# EAGLE design Backplane (EAGLE 8.5.1)
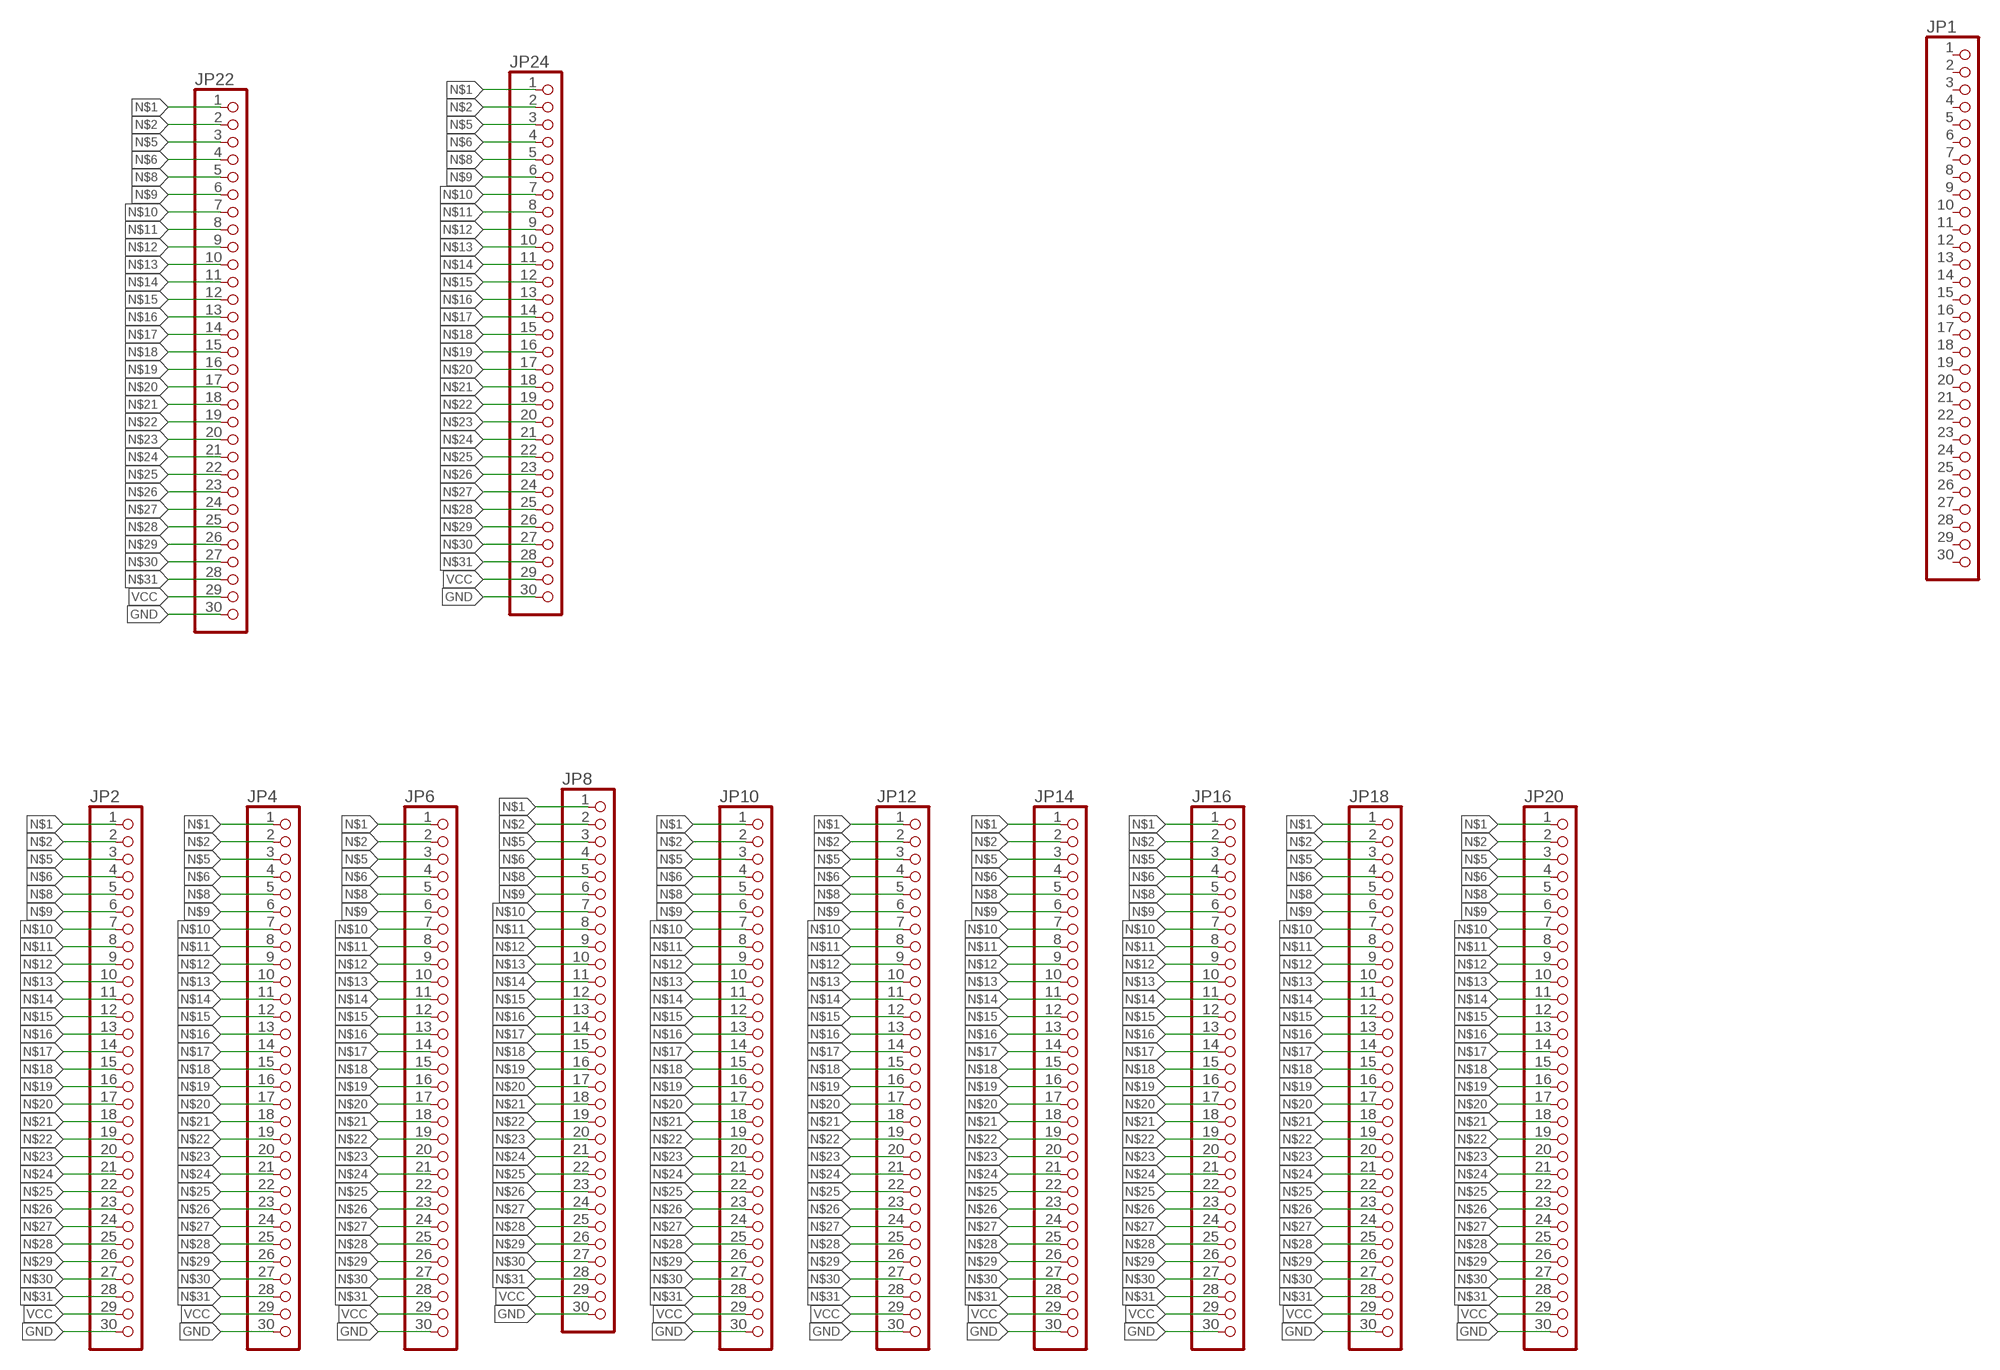
[diagram p0: schematic, sheet 1]

## Parts
JP1  PINHD-1X30  [1X30]
JP2  PINHD-1X30  [1X30]
JP4  PINHD-1X30  [1X30]
JP6  PINHD-1X30  [1X30]
JP8  PINHD-1X30  [1X30]
JP10  PINHD-1X30  [1X30]
JP12  PINHD-1X30  [1X30]
JP14  PINHD-1X30  [1X30]
JP16  PINHD-1X30  [1X30]
JP18  PINHD-1X30  [1X30]
JP20  PINHD-1X30  [1X30]
JP22  PINHD-1X30  [1X30]
JP24  PINHD-1X30  [1X30]

## Nets
GND: JP2.30 JP4.30 JP6.30 JP8.30 JP10.30 JP12.30 JP14.30 JP16.30 JP18.30 JP20.30 JP22.30 JP24.30
N$1: JP2.1 JP4.1 JP6.1 JP8.1 JP10.1 JP12.1 JP14.1 JP16.1 JP18.1 JP20.1 JP22.1 JP24.1
N$2: JP2.2 JP4.2 JP6.2 JP8.2 JP10.2 JP12.2 JP14.2 JP16.2 JP18.2 JP20.2 JP22.2 JP24.2
N$5: JP2.3 JP4.3 JP6.3 JP8.3 JP10.3 JP12.3 JP14.3 JP16.3 JP18.3 JP20.3 JP22.3 JP24.3
N$6: JP2.4 JP4.4 JP6.4 JP8.4 JP10.4 JP12.4 JP14.4 JP16.4 JP18.4 JP20.4 JP22.4 JP24.4
N$8: JP2.5 JP4.5 JP6.5 JP8.5 JP10.5 JP12.5 JP14.5 JP16.5 JP18.5 JP20.5 JP22.5 JP24.5
N$9: JP2.6 JP4.6 JP6.6 JP8.6 JP10.6 JP12.6 JP14.6 JP16.6 JP18.6 JP20.6 JP22.6 JP24.6
N$10: JP2.7 JP4.7 JP6.7 JP8.7 JP10.7 JP12.7 JP14.7 JP16.7 JP18.7 JP20.7 JP22.7 JP24.7
N$11: JP2.8 JP4.8 JP6.8 JP8.8 JP10.8 JP12.8 JP14.8 JP16.8 JP18.8 JP20.8 JP22.8 JP24.8
N$12: JP2.9 JP4.9 JP6.9 JP8.9 JP10.9 JP12.9 JP14.9 JP16.9 JP18.9 JP20.9 JP22.9 JP24.9
N$13: JP2.10 JP4.10 JP6.10 JP8.10 JP10.10 JP12.10 JP14.10 JP16.10 JP18.10 JP20.10 JP22.10 JP24.10
N$14: JP2.11 JP4.11 JP6.11 JP8.11 JP10.11 JP12.11 JP14.11 JP16.11 JP18.11 JP20.11 JP22.11 JP24.11
N$15: JP2.12 JP4.12 JP6.12 JP8.12 JP10.12 JP12.12 JP14.12 JP16.12 JP18.12 JP20.12 JP22.12 JP24.12
N$16: JP2.13 JP4.13 JP6.13 JP8.13 JP10.13 JP12.13 JP14.13 JP16.13 JP18.13 JP20.13 JP22.13 JP24.13
N$17: JP2.14 JP4.14 JP6.14 JP8.14 JP10.14 JP12.14 JP14.14 JP16.14 JP18.14 JP20.14 JP22.14 JP24.14
N$18: JP2.15 JP4.15 JP6.15 JP8.15 JP10.15 JP12.15 JP14.15 JP16.15 JP18.15 JP20.15 JP22.15 JP24.15
N$19: JP2.16 JP4.16 JP6.16 JP8.16 JP10.16 JP12.16 JP14.16 JP16.16 JP18.16 JP20.16 JP22.16 JP24.16
N$20: JP2.17 JP4.17 JP6.17 JP8.17 JP10.17 JP12.17 JP14.17 JP16.17 JP18.17 JP20.17 JP22.17 JP24.17
N$21: JP2.18 JP4.18 JP6.18 JP8.18 JP10.18 JP12.18 JP14.18 JP16.18 JP18.18 JP20.18 JP22.18 JP24.18
N$22: JP2.19 JP4.19 JP6.19 JP8.19 JP10.19 JP12.19 JP14.19 JP16.19 JP18.19 JP20.19 JP22.19 JP24.19
N$23: JP2.20 JP4.20 JP6.20 JP8.20 JP10.20 JP12.20 JP14.20 JP16.20 JP18.20 JP20.20 JP22.20 JP24.20
N$24: JP2.21 JP4.21 JP6.21 JP8.21 JP10.21 JP12.21 JP14.21 JP16.21 JP18.21 JP20.21 JP22.21 JP24.21
N$25: JP2.22 JP4.22 JP6.22 JP8.22 JP10.22 JP12.22 JP14.22 JP16.22 JP18.22 JP20.22 JP22.22 JP24.22
N$26: JP2.23 JP4.23 JP6.23 JP8.23 JP10.23 JP12.23 JP14.23 JP16.23 JP18.23 JP20.23 JP22.23 JP24.23
N$27: JP2.24 JP4.24 JP6.24 JP8.24 JP10.24 JP12.24 JP14.24 JP16.24 JP18.24 JP20.24 JP22.24 JP24.24
N$28: JP2.25 JP4.25 JP6.25 JP8.25 JP10.25 JP12.25 JP14.25 JP16.25 JP18.25 JP20.25 JP22.25 JP24.25
N$29: JP2.26 JP4.26 JP6.26 JP8.26 JP10.26 JP12.26 JP14.26 JP16.26 JP18.26 JP20.26 JP22.26 JP24.26
N$30: JP2.27 JP4.27 JP6.27 JP8.27 JP10.27 JP12.27 JP14.27 JP16.27 JP18.27 JP20.27 JP22.27 JP24.27
N$31: JP2.28 JP4.28 JP6.28 JP8.28 JP10.28 JP12.28 JP14.28 JP16.28 JP18.28 JP20.28 JP22.28 JP24.28
VCC: JP2.29 JP4.29 JP6.29 JP8.29 JP10.29 JP12.29 JP14.29 JP16.29 JP18.29 JP20.29 JP22.29 JP24.29
Unconnected: JP1.1 JP1.2 JP1.3 JP1.4 JP1.5 JP1.6 JP1.7 JP1.8 JP1.9 JP1.10 JP1.11 JP1.12 JP1.13 JP1.14 JP1.15 JP1.16 JP1.17 JP1.18 JP1.19 JP1.20 JP1.21 JP1.22 JP1.23 JP1.24 JP1.25 JP1.26 JP1.27 JP1.28 JP1.29 JP1.30

## Library data of the parts
JP1 JP2 JP4 JP6 JP8 JP10 JP12 JP14 JP16 JP18 JP20 JP22 JP24 = XSNOR:PINHD-1X30: PIN HEADER

## Board
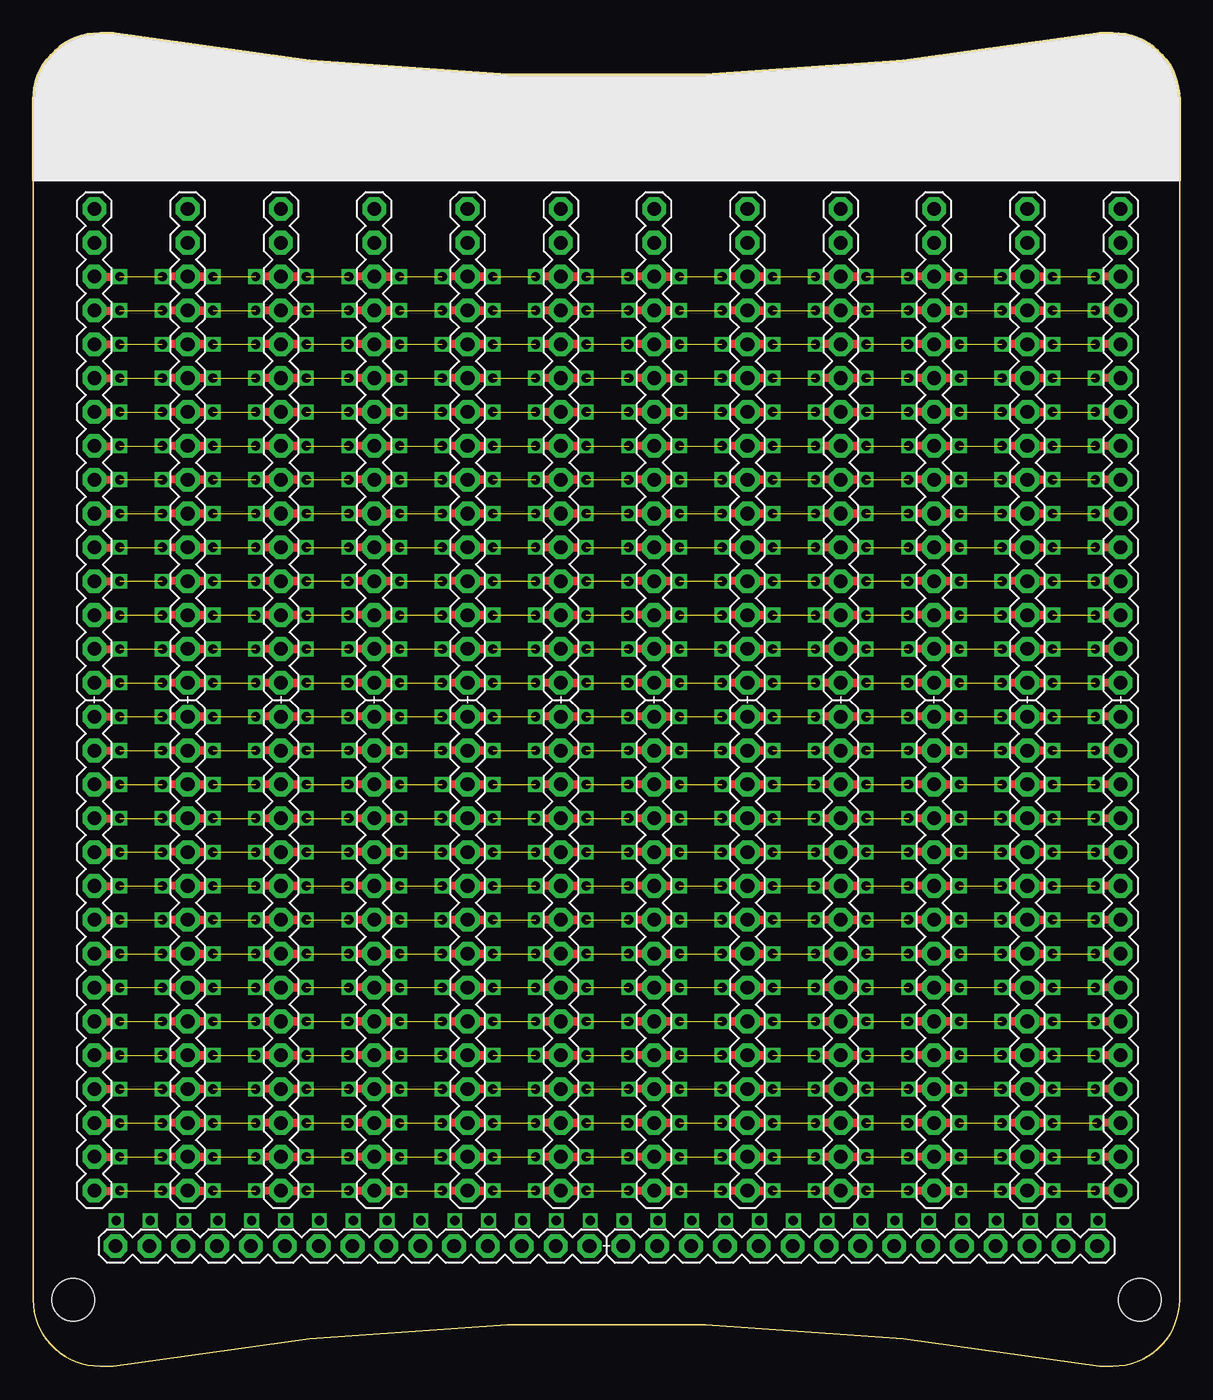
[diagram p1: board, top side]
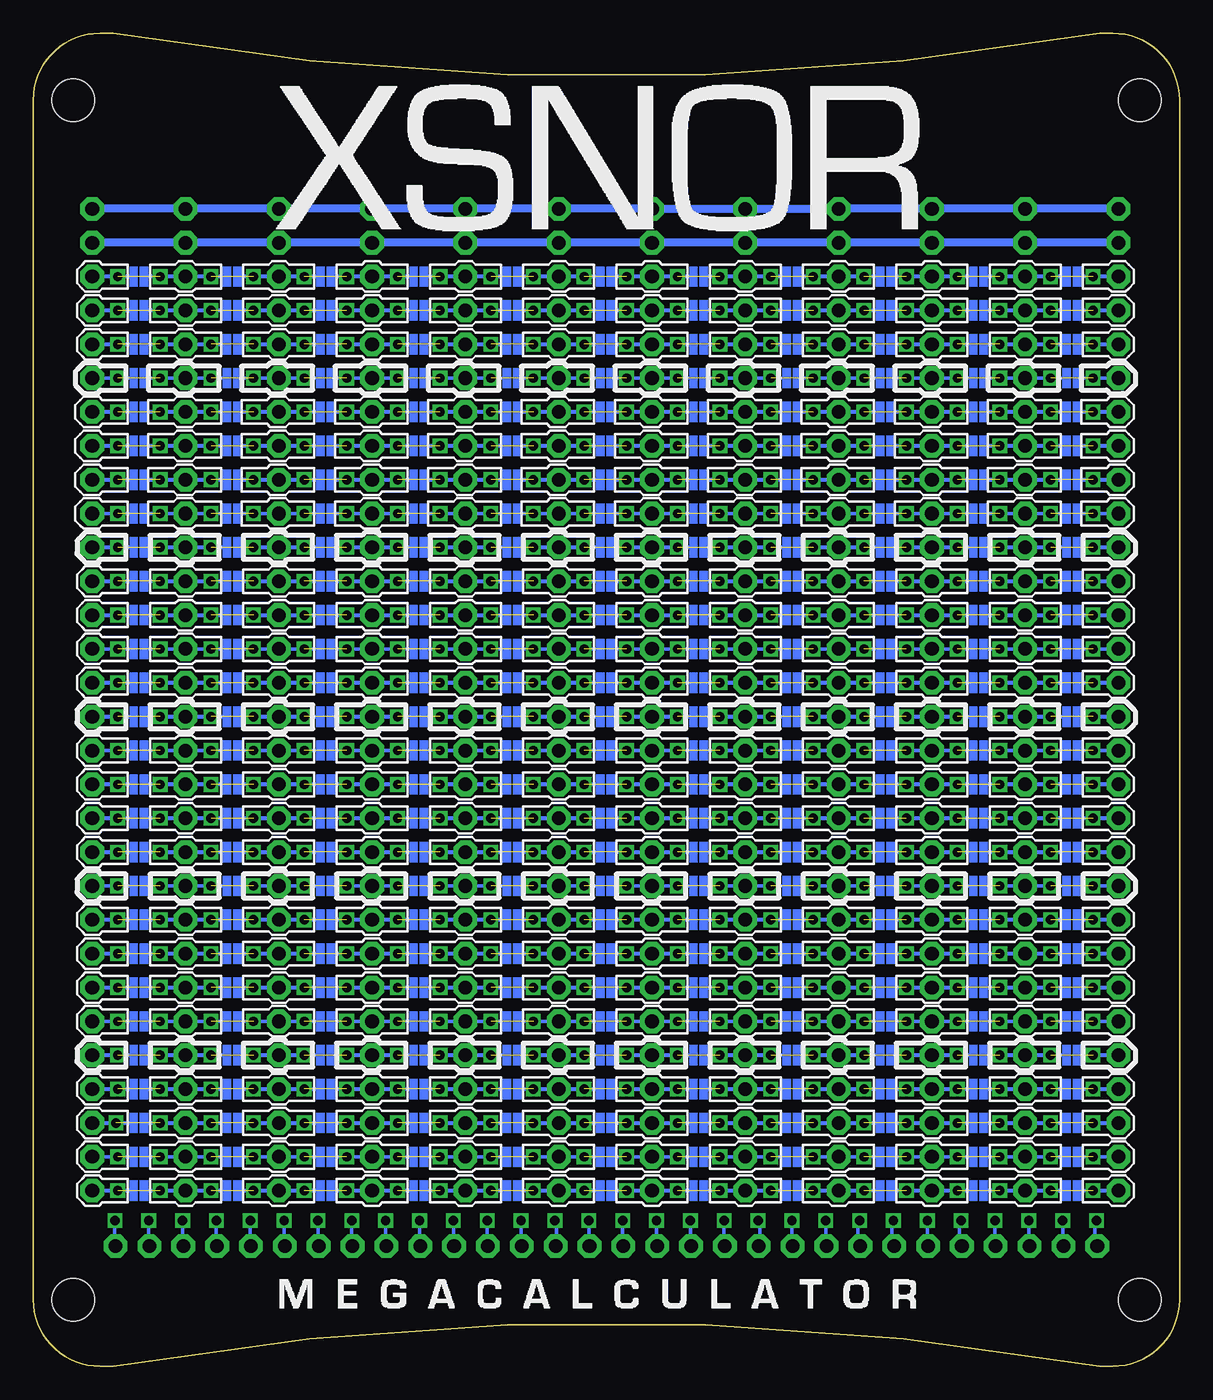
[diagram p2: board, bottom side, seen from below]

Size 86 x 100 mm. Coordinates in mm from the lower left corner, seen from the top.
Outline: 0,50 0,5 arc90 5,0 6,0 arc-20 80,0 81,0 arc90 86,5 86,50 86,95 arc90 81,100 80,100 arc-20 6,100 5,100 arc90 0,95 0,50
Copper layers (1*16): Top 0.035mm / dielectric 1.5mm / Bottom 0.035mm
Design rules "PCBway": minimum track width 6mil, minimum drill 0.3mm, track to track 0.205mm, track to pad 0.205mm, pad to pad 0.205mm, via to via 0.205mm, smd to smd 8mil, copper to edge 40mil, drill to drill 8mil, minimum pad ring 10mil, minimum via ring 8mil, stop-mask expansion 4mil, vias tented up to drill 25mil, thermal gap 10mil
Holes 3.2 mm at 3,95 83,95 83,5 3,5

### Footprints (pad centres in the part's own frame; a part is rotated, then mirrored left to right if it is on the bottom)
1X30 = drill 1.016 pad 1.778 octagon: 1 -36.83,0; 2 -34.29,0; 3 -31.75,0; 4 -29.21,0; 5 -26.67,0; 6 -24.13,0; 7 -21.59,0; 8 -19.05,0; 9 -16.51,0; 10 -13.97,0; 11 -11.43,0; 12 -8.89,0; 13 -6.35,0; 14 -3.81,0; 15 -1.27,0; 16 1.27,0; 17 3.81,0; 18 6.35,0; 19 8.89,0; 20 11.43,0; 21 13.97,0; 22 16.51,0; 23 19.05,0; 24 21.59,0; 25 24.13,0; 26 26.67,0; 27 29.21,0; 28 31.75,0; 29 34.29,0; 30 36.83,0

### Placement (x,y rotation side)
JP1  43,9.02 0 top
JP2  11.58,50 90 top
JP4  18.58,50 90 top
JP6  25.58,50 90 top
JP8  32.58,50 90 top
JP10  39.58,50 90 top
JP12  46.58,50 90 top
JP14  53.58,50 90 top
JP16  60.58,50 90 top
JP18  67.58,50 90 top
JP20  74.58,50 90 top
JP22  4.58,50 90 top
JP24  81.58,50 90 top

### Tracks (layer width: path | path; a pad name or v marks a point on that pad's centre or on a via)
GND
  Bottom 0.61: JP22.30 JP2.30 JP4.30 JP6.30 JP8.30 JP10.30 JP12.30 JP14.30 JP16.30 JP18.30 JP20.30 JP24.30
N$1  (via drill 0.7)  (11 unrouted)
  Top 0.61: JP2.1 v13.48,13.17 v9.68,13.17 | JP4.1 v20.48,13.17 v16.68,13.17 | JP6.1 v27.48,13.17 v23.68,13.17 | JP8.1 v34.48,13.17 v30.68,13.17 | JP10.1 v41.48,13.17 v37.67,13.17 | JP12.1 v48.48,13.17 v44.67,13.17 | JP14.1 v55.48,13.17 v51.67,13.17 | JP16.1 v62.48,13.17 v58.67,13.17 | JP18.1 v69.48,13.17 v65.67,13.17 | JP20.1 v76.48,13.17 v72.67,13.17 | JP22.1 v6.49,13.17 | JP24.1 81.36,13.17 v79.67,13.17
N$2  (via drill 0.7)  (11 unrouted)
  Top 0.61: JP2.2 v13.48,15.71 v9.68,15.71 | JP4.2 v20.48,15.71 v16.68,15.71 | JP6.2 v27.48,15.71 v23.68,15.71 | JP8.2 v34.48,15.71 v30.68,15.71 | JP10.2 v41.48,15.71 v37.67,15.71 | JP12.2 v48.48,15.71 v44.67,15.71 | JP14.2 v55.48,15.71 v51.67,15.71 | JP16.2 v62.48,15.71 v58.67,15.71 | JP18.2 v69.48,15.71 v65.67,15.71 | JP20.2 v76.48,15.71 v72.67,15.71 | JP22.2 v6.49,15.71 | JP24.2 81.36,15.71 v79.67,15.71
N$3  (via drill 0.7)
  other vias: 79.88,10.92
N$4  (via drill 0.7)
  Bottom 0.254: v77.34,10.92 77.34,9.14 arc90 77.47,9.02
N$5  (via drill 0.7)  (11 unrouted)
  Top 0.61: JP2.3 v13.48,18.25 v9.68,18.25 | JP4.3 v20.48,18.25 v16.68,18.25 | JP6.3 v27.48,18.25 v23.68,18.25 | JP8.3 v34.48,18.25 v30.68,18.25 | JP10.3 v41.48,18.25 v37.67,18.25 | JP12.3 v48.48,18.25 v44.67,18.25 | JP14.3 v55.48,18.25 v51.67,18.25 | JP16.3 v62.48,18.25 v58.67,18.25 | JP18.3 v69.48,18.25 v65.67,18.25 | JP20.3 v76.48,18.25 v72.67,18.25 | JP22.3 v6.49,18.25 | JP24.3 81.36,18.25 v79.8,18.25
N$6  (via drill 0.7)  (11 unrouted)
  Top 0.61: JP2.4 v13.48,20.79 v9.68,20.79 | JP4.4 v20.48,20.79 v16.68,20.79 | JP6.4 v27.48,20.79 v23.68,20.79 | JP8.4 v34.48,20.79 v30.68,20.79 | JP10.4 v41.48,20.79 v37.67,20.79 | JP12.4 v48.48,20.79 v44.67,20.79 | JP14.4 v55.48,20.79 v51.67,20.79 | JP16.4 v62.48,20.79 v58.67,20.79 | JP18.4 v69.48,20.79 v65.67,20.79 | JP20.4 v76.48,20.79 v72.67,20.79 | JP22.4 v6.49,20.79 | JP24.4 81.36,20.79 v79.67,20.79
N$7  (via drill 0.7)
  Bottom 0.254: v74.8,10.92 74.8,9.02
N$8  (via drill 0.7)  (11 unrouted)
  Top 0.61: JP2.5 v13.48,23.33 v9.68,23.33 | JP4.5 v20.48,23.33 v16.68,23.33 | JP6.5 v27.48,23.33 v23.68,23.33 | JP8.5 v34.48,23.33 v30.68,23.33 | JP10.5 v41.48,23.33 v37.67,23.33 | JP12.5 v48.48,23.33 v44.67,23.33 | JP14.5 v55.48,23.33 v51.67,23.33 | JP16.5 v62.48,23.33 v58.67,23.33 | JP18.5 v69.48,23.33 v65.67,23.33 | JP20.5 v76.48,23.33 v72.67,23.33 | JP22.5 v6.49,23.33 | JP24.5 81.36,23.33 v79.67,23.33
N$9  (via drill 0.7)  (11 unrouted)
  Top 0.61: JP2.6 v13.48,25.87 | v13.48,25.87 v9.68,25.87 v13.48,25.87 | JP4.6 v20.48,25.87 | v20.48,25.87 v16.68,25.87 v20.48,25.87 | JP6.6 v27.48,25.87 | v27.48,25.87 v23.68,25.87 v27.48,25.87 | JP8.6 v34.48,25.87 | v34.48,25.87 v30.68,25.87 v34.48,25.87 | JP10.6 v41.48,25.87 | v41.48,25.87 v37.67,25.87 v41.48,25.87 | JP12.6 v48.48,25.87 | v48.48,25.87 v44.67,25.87 v48.48,25.87 | JP14.6 v55.48,25.87 | v55.48,25.87 v51.67,25.87 v55.48,25.87 | JP16.6 v62.48,25.87 | v62.48,25.87 v58.67,25.87 v62.48,25.87 | JP18.6 v69.48,25.87 | v69.48,25.87 v65.67,25.87 v69.48,25.87 | JP20.6 v76.48,25.87 | v76.48,25.87 v72.67,25.87 v76.48,25.87 | JP22.6 v6.49,25.87 | JP24.6 81.36,25.87 | 81.36,25.87 v79.67,25.87 81.36,25.87
N$10  (via drill 0.7)  (11 unrouted)
  Top 0.61: JP2.7 v13.48,28.41 v9.68,28.41 | JP4.7 v20.48,28.41 v16.68,28.41 | JP6.7 v27.48,28.41 v23.68,28.41 | JP8.7 v34.48,28.41 v30.68,28.41 | JP10.7 v41.48,28.41 v37.67,28.41 | JP12.7 v48.48,28.41 v44.67,28.41 | JP14.7 v55.48,28.41 v51.67,28.41 | JP16.7 v62.48,28.41 v58.67,28.41 | JP18.7 v69.48,28.41 v65.67,28.41 | JP20.7 v76.48,28.41 v72.67,28.41 | JP22.7 v6.49,28.41 | JP24.7 81.36,28.41 v79.67,28.41
N$11  (via drill 0.7)  (11 unrouted)
  Top 0.61: JP2.8 v13.48,30.95 v9.68,30.95 | JP4.8 v20.48,30.95 v16.68,30.95 | JP6.8 v27.48,30.95 v23.68,30.95 | JP8.8 v34.48,30.95 v30.68,30.95 | JP10.8 v41.48,30.95 v37.67,30.95 | JP12.8 v48.48,30.95 v44.67,30.95 | JP14.8 v55.48,30.95 v51.67,30.95 | JP16.8 v62.48,30.95 v58.67,30.95 | JP18.8 v69.48,30.95 v65.67,30.95 | JP20.8 v76.48,30.95 v72.67,30.95 | JP22.8 v6.49,30.95 | JP24.8 81.36,30.95 v79.67,30.95
N$12  (via drill 0.7)  (11 unrouted)
  Top 0.61: JP2.9 v13.48,33.49 v9.68,33.49 | JP4.9 v20.48,33.49 v16.68,33.49 | JP6.9 v27.48,33.49 v23.68,33.49 | JP8.9 v34.48,33.49 v30.68,33.49 | JP10.9 v41.48,33.49 v37.67,33.49 | JP12.9 v48.48,33.49 v44.67,33.49 | JP14.9 v55.48,33.49 v51.67,33.49 | JP16.9 v62.48,33.49 v58.67,33.49 | JP18.9 v69.48,33.49 v65.67,33.49 | JP20.9 v76.48,33.49 v72.67,33.49 | JP22.9 v6.49,33.49 | JP24.9 81.36,33.49 v79.67,33.49
N$13  (via drill 0.7)  (11 unrouted)
  Top 0.61: JP2.10 v13.48,36.03 v9.68,36.03 | JP4.10 v20.48,36.03 v16.68,36.03 | JP6.10 v27.48,36.03 v23.68,36.03 | JP8.10 v34.48,36.03 v30.68,36.03 | JP10.10 v41.48,36.03 v37.67,36.03 | JP12.10 v48.48,36.03 v44.67,36.03 | JP14.10 v55.48,36.03 v51.67,36.03 | JP16.10 v62.48,36.03 v58.67,36.03 | JP18.10 v69.48,36.03 v65.67,36.03 | JP20.10 v76.48,36.03 v72.67,36.03 | JP22.10 v6.49,36.03 | JP24.10 81.36,36.03 v79.67,36.03
N$14  (via drill 0.7)  (11 unrouted)
  Top 0.61: JP2.11 v13.48,38.57 v9.68,38.57 | JP4.11 v20.48,38.57 v16.68,38.57 | JP6.11 v27.48,38.57 v23.68,38.57 | JP8.11 v34.48,38.57 v30.68,38.57 | JP10.11 v41.48,38.57 v37.67,38.57 | JP12.11 v48.48,38.57 v44.67,38.57 | JP14.11 v55.48,38.57 v51.67,38.57 | JP16.11 v62.48,38.57 v58.67,38.57 | JP18.11 v69.48,38.57 v65.67,38.57 | JP20.11 v76.48,38.57 v72.67,38.57 | JP22.11 v6.49,38.57 | JP24.11 81.36,38.57 v79.67,38.57
N$15  (via drill 0.7)  (11 unrouted)
  Top 0.61: JP2.12 v13.48,41.11 v9.68,41.11 | JP4.12 v20.48,41.11 v16.68,41.11 | JP6.12 v27.48,41.11 v23.68,41.11 | JP8.12 v34.48,41.11 v30.68,41.11 | JP10.12 v41.48,41.11 v37.67,41.11 | JP12.12 v48.48,41.11 v44.67,41.11 | JP14.12 v55.48,41.11 v51.67,41.11 | JP16.12 v62.48,41.11 v58.67,41.11 | JP18.12 v69.48,41.11 v65.67,41.11 | JP20.12 v76.48,41.11 v72.67,41.11 | JP22.12 v6.49,41.11 | JP24.12 81.36,41.11 v79.67,41.11
N$16  (via drill 0.7)  (11 unrouted)
  Top 0.61: JP2.13 v13.48,43.65 v9.68,43.65 | JP4.13 v20.48,43.65 v16.68,43.65 | JP6.13 v27.48,43.65 v23.68,43.65 | JP8.13 v34.48,43.65 v30.68,43.65 | JP10.13 v41.48,43.65 v37.67,43.65 | JP12.13 v48.48,43.65 v44.67,43.65 | JP14.13 v55.48,43.65 v51.67,43.65 | JP16.13 v62.48,43.65 v58.67,43.65 | JP18.13 v69.48,43.65 v65.67,43.65 | JP20.13 v76.48,43.65 v72.67,43.65 | JP22.13 v6.49,43.65 | JP24.13 81.36,43.65 v79.67,43.65
N$17  (via drill 0.7)  (11 unrouted)
  Top 0.61: JP2.14 v13.48,46.19 v9.68,46.19 | JP4.14 v20.48,46.19 v16.68,46.19 | JP6.14 v27.48,46.19 v23.68,46.19 | JP8.14 v34.48,46.19 v30.68,46.19 | JP10.14 v41.48,46.19 v37.67,46.19 | JP12.14 v48.48,46.19 v44.67,46.19 | JP14.14 v55.48,46.19 v51.67,46.19 | JP16.14 v62.48,46.19 v58.67,46.19 | JP18.14 v69.48,46.19 v65.67,46.19 | JP20.14 v76.48,46.19 v72.67,46.19 | JP22.14 v6.49,46.19 | JP24.14 81.36,46.19 v79.67,46.19
N$18  (via drill 0.7)  (11 unrouted)
  Top 0.61: JP2.15 v13.48,48.73 v9.68,48.73 | JP4.15 v20.48,48.73 v16.68,48.73 | JP6.15 v27.48,48.73 v23.68,48.73 | JP8.15 v34.48,48.73 v30.68,48.73 | JP10.15 v41.48,48.73 v37.67,48.73 | JP12.15 v48.48,48.73 v44.67,48.73 | JP14.15 v55.48,48.73 v51.67,48.73 | JP16.15 v62.48,48.73 v58.67,48.73 | JP18.15 v69.48,48.73 v65.67,48.73 | JP20.15 v76.48,48.73 v72.67,48.73 | JP22.15 v6.49,48.73 | JP24.15 81.36,48.73 v79.67,48.73
N$19  (via drill 0.7)  (11 unrouted)
  Top 0.61: JP2.16 v13.48,51.27 v9.68,51.27 | JP4.16 v20.48,51.27 v16.68,51.27 | JP6.16 v27.48,51.27 v23.68,51.27 | JP8.16 v34.48,51.27 v30.68,51.27 | JP10.16 v41.48,51.27 v37.67,51.27 | JP12.16 v48.48,51.27 v44.67,51.27 | JP14.16 v55.48,51.27 v51.67,51.27 | JP16.16 v62.48,51.27 v58.67,51.27 | JP18.16 v69.48,51.27 v65.67,51.27 | JP20.16 v76.48,51.27 v72.67,51.27 | JP22.16 v6.49,51.27 | JP24.16 81.36,51.27 v79.67,51.27
N$20  (via drill 0.7)  (11 unrouted)
  Top 0.61: JP2.17 v13.48,53.81 v9.68,53.81 | JP4.17 v20.48,53.81 v16.68,53.81 | JP6.17 v27.48,53.81 v23.68,53.81 | JP8.17 v34.48,53.81 v30.68,53.81 | JP10.17 v41.48,53.81 v37.67,53.81 | JP12.17 v48.48,53.81 v44.67,53.81 | JP14.17 v55.48,53.81 v51.67,53.81 | JP16.17 v62.48,53.81 v58.67,53.81 | JP18.17 v69.48,53.81 v65.67,53.81 | JP20.17 v76.48,53.81 v72.67,53.81 | JP22.17 v6.49,53.81 | JP24.17 81.36,53.81 v79.67,53.81
N$21  (via drill 0.7)  (11 unrouted)
  Top 0.61: JP2.18 v13.48,56.35 v9.68,56.35 | JP4.18 v20.48,56.35 v16.68,56.35 | JP6.18 v27.48,56.35 v23.68,56.35 | JP8.18 v34.48,56.35 v30.68,56.35 | JP10.18 v41.48,56.35 v37.67,56.35 | JP12.18 v48.48,56.35 v44.67,56.35 | JP14.18 v55.48,56.35 v51.67,56.35 | JP16.18 v62.48,56.35 v58.67,56.35 | JP18.18 v69.48,56.35 v65.67,56.35 | JP20.18 v76.48,56.35 v72.67,56.35 | JP22.18 v6.49,56.35 | JP24.18 81.36,56.35 v79.67,56.35
N$22  (via drill 0.7)  (11 unrouted)
  Top 0.61: JP2.19 v13.48,58.89 v9.68,58.89 | JP4.19 v20.48,58.89 v16.68,58.89 | JP6.19 v27.48,58.89 v23.68,58.89 | JP8.19 v34.48,58.89 v30.68,58.89 | JP10.19 v41.48,58.89 v37.67,58.89 | JP12.19 v48.48,58.89 v44.67,58.89 | JP14.19 v55.48,58.89 v51.67,58.89 | JP16.19 v62.48,58.89 v58.67,58.89 | JP18.19 v69.48,58.89 v65.67,58.89 | JP20.19 v76.48,58.89 v72.67,58.89 | JP22.19 v6.49,58.89 | JP24.19 81.36,58.89 v79.67,58.89
N$23  (via drill 0.7)  (11 unrouted)
  Top 0.61: JP2.20 v13.48,61.43 v9.68,61.43 | JP4.20 v20.48,61.43 v16.68,61.43 | JP6.20 v27.48,61.43 v23.68,61.43 | JP8.20 v34.48,61.43 v30.68,61.43 | JP10.20 v41.48,61.43 v37.67,61.43 | JP12.20 v48.48,61.43 v44.67,61.43 | JP14.20 v55.48,61.43 v51.67,61.43 | JP16.20 v62.48,61.43 v58.67,61.43 | JP18.20 v69.48,61.43 v65.67,61.43 | JP20.20 v76.48,61.43 v72.67,61.43 | JP22.20 v6.49,61.43 | JP24.20 81.36,61.43 v79.67,61.43
N$24  (via drill 0.7)  (11 unrouted)
  Top 0.61: JP2.21 v13.48,63.97 v9.68,63.97 | JP4.21 v20.48,63.97 v16.68,63.97 | JP6.21 v27.48,63.97 v23.68,63.97 | JP8.21 v34.48,63.97 v30.68,63.97 | JP10.21 v41.48,63.97 v37.67,63.97 | JP12.21 v48.48,63.97 v44.67,63.97 | JP14.21 v55.48,63.97 v51.67,63.97 | JP16.21 v62.48,63.97 v58.67,63.97 | JP18.21 v69.48,63.97 v65.67,63.97 | JP20.21 v76.48,63.97 v72.67,63.97 | JP22.21 v6.49,63.97 | JP24.21 81.36,63.97 v79.67,63.97
N$25  (via drill 0.7)  (11 unrouted)
  Top 0.61: JP2.22 v13.48,66.51 v9.68,66.51 | JP4.22 v20.48,66.51 v16.68,66.51 | JP6.22 v27.48,66.51 v23.68,66.51 | JP8.22 v34.48,66.51 v30.68,66.51 | JP10.22 v41.48,66.51 v37.67,66.51 | JP12.22 v48.48,66.51 v44.67,66.51 | JP14.22 v55.48,66.51 v51.67,66.51 | JP16.22 v62.48,66.51 v58.67,66.51 | JP18.22 v69.48,66.51 v65.67,66.51 | JP20.22 v76.48,66.51 v72.67,66.51 | JP22.22 v6.49,66.51 | JP24.22 81.36,66.51 v79.67,66.51
N$26  (via drill 0.7)  (11 unrouted)
  Top 0.61: JP2.23 v13.48,69.05 v9.68,69.05 | JP4.23 v20.48,69.05 v16.68,69.05 | JP6.23 v27.48,69.05 v23.68,69.05 | JP8.23 v34.48,69.05 v30.68,69.05 | JP10.23 v41.48,69.05 v37.67,69.05 | JP12.23 v48.48,69.05 v44.67,69.05 | JP14.23 v55.48,69.05 v51.67,69.05 | JP16.23 v62.48,69.05 v58.67,69.05 | JP18.23 v69.48,69.05 v65.67,69.05 | JP20.23 v76.48,69.05 v72.67,69.05 | JP22.23 v6.49,69.05 | JP24.23 81.36,69.05 v79.67,69.05
N$27  (via drill 0.7)  (11 unrouted)
  Top 0.61: JP2.24 v13.48,71.59 v9.68,71.59 | JP4.24 v20.48,71.59 v16.68,71.59 | JP6.24 v27.48,71.59 v23.68,71.59 | JP8.24 v34.48,71.59 v30.68,71.59 | JP10.24 v41.48,71.59 v37.67,71.59 | JP12.24 v48.48,71.59 v44.67,71.59 | JP14.24 v55.48,71.59 v51.67,71.59 | JP16.24 v62.48,71.59 v58.67,71.59 | JP18.24 v69.48,71.59 v65.67,71.59 | JP20.24 v76.48,71.59 v72.67,71.59 | JP22.24 v6.49,71.59 | JP24.24 81.36,71.59 v79.67,71.59
N$28  (via drill 0.7)  (11 unrouted)
  Top 0.61: JP2.25 v13.48,74.13 v9.68,74.13 | JP4.25 v20.48,74.13 v16.68,74.13 | JP6.25 v27.48,74.13 v23.68,74.13 | JP8.25 v34.48,74.13 v30.68,74.13 | JP10.25 v41.48,74.13 v37.67,74.13 | JP12.25 v48.48,74.13 v44.67,74.13 | JP14.25 v55.48,74.13 v51.67,74.13 | JP16.25 v62.48,74.13 v58.67,74.13 | JP18.25 v69.48,74.13 v65.67,74.13 | JP20.25 v76.48,74.13 v72.67,74.13 | JP22.25 v6.49,74.13 | JP24.25 81.36,74.13 v79.67,74.13
N$29  (via drill 0.7)  (11 unrouted)
  Top 0.61: JP2.26 v13.48,76.67 v9.68,76.67 | JP4.26 v20.48,76.67 v16.68,76.67 | JP6.26 v27.48,76.67 v23.68,76.67 | JP8.26 v34.48,76.67 v30.68,76.67 | JP10.26 v41.48,76.67 v37.67,76.67 | JP12.26 v48.48,76.67 v44.67,76.67 | JP14.26 v55.48,76.67 v51.67,76.67 | JP16.26 v62.48,76.67 v58.67,76.67 | JP18.26 v69.48,76.67 v65.67,76.67 | JP20.26 v76.48,76.67 v72.67,76.67 | JP22.26 v6.49,76.67 | JP24.26 81.36,76.67 v79.67,76.67
N$30  (via drill 0.7)  (11 unrouted)
  Top 0.61: JP2.27 v13.48,79.21 v9.68,79.21 | JP4.27 v20.48,79.21 v16.68,79.21 | JP6.27 v27.48,79.21 v23.68,79.21 | JP8.27 v34.48,79.21 v30.68,79.21 | JP10.27 v41.48,79.21 v37.67,79.21 | JP12.27 v48.48,79.21 v44.67,79.21 | JP14.27 v55.48,79.21 v51.67,79.21 | JP16.27 v62.48,79.21 v58.67,79.21 | JP18.27 v69.48,79.21 v65.67,79.21 | JP20.27 v76.48,79.21 v72.67,79.21 | JP22.27 v6.49,79.21 | JP24.27 81.36,79.21 v79.67,79.21
N$31  (via drill 0.7)  (11 unrouted)
  Top 0.61: JP2.28 v13.48,81.75 v9.68,81.75 | JP4.28 v20.48,81.75 v16.68,81.75 | JP6.28 v27.48,81.75 v23.68,81.75 | JP8.28 v34.48,81.75 v30.68,81.75 | JP10.28 v41.48,81.75 v37.67,81.75 | JP12.28 v48.48,81.75 v44.67,81.75 | JP14.28 v55.48,81.75 v51.67,81.75 | JP16.28 v62.48,81.75 v58.67,81.75 | JP18.28 v69.48,81.75 v65.67,81.75 | JP20.28 v76.48,81.75 v72.67,81.75 | JP22.28 v6.49,81.75 | JP24.28 81.36,81.75 v79.67,81.75
N$32  (via drill 0.7)
  Bottom 0.254: v72.26,10.92 72.26,8.89
N$33  (via drill 0.7)
  Bottom 0.254: v69.72,10.92 69.72,9.02
N$34  (via drill 0.7)
  Bottom 0.254: v67.18,10.92 67.18,9.02
N$35  (via drill 0.7)
  Bottom 0.254: v64.64,10.92 64.64,8.89
N$36  (via drill 0.7)
  Bottom 0.254: v62.1,10.92 62.1,8.89
N$37  (via drill 0.7)
  Bottom 0.254: v59.56,10.92 59.56,9.02
N$38  (via drill 0.7)
  Bottom 0.254: v57.02,10.92 57.02,9.02
N$39  (via drill 0.7)
  Bottom 0.254: v54.48,10.92 54.48,9.02
N$40  (via drill 0.7)
  Bottom 0.254: v51.94,10.92 51.94,9.14 arc-90 51.82,9.02
N$41  (via drill 0.7)
  Bottom 0.254: v49.4,10.92 49.4,8.89
N$42  (via drill 0.7)
  other vias: 46.86,10.92
N$43  (via drill 0.7)
  Bottom 0.254: v44.32,10.92 44.32,9.02
N$44  (via drill 0.7)
  Bottom 0.254: v41.78,10.92 41.78,9.02 arc90 41.91,8.89
N$45  (via drill 0.7)
  other vias: 39.24,10.92
N$46  (via drill 0.7)
  Bottom 0.254: v36.7,10.92 36.7,9.14 arc-90 36.58,9.02
N$47  (via drill 0.7)
  Bottom 0.254: v34.16,10.92 34.16,9.02
N$48  (via drill 0.7)
  other vias: 31.62,10.92
N$49  (via drill 0.7)
  other vias: 29.08,10.92
N$50  (via drill 0.7)
  Bottom 0.254: v26.54,10.92 26.54,9.02
N$51  (via drill 0.7)
  other vias: 24,10.92
N$52  (via drill 0.7)
  other vias: 21.46,10.92
N$53  (via drill 0.7)
  Bottom 0.254: v18.92,10.92 18.92,8.89
N$54  (via drill 0.7)
  other vias: 16.38,10.92
N$55  (via drill 0.7)
  other vias: 13.84,10.92
N$56  (via drill 0.7)
  other vias: 11.3,10.92
N$57  (via drill 0.7)
  other vias: 8.76,10.92
N$58  (via drill 0.7)
  other vias: 6.22,10.92
N$59
  Bottom 0.254: 79.76,10.79 arc-90 79.88,10.67 79.88,9.02
N$60
  Bottom 0.254: 46.74,10.79 46.74,9.02 arc90 46.86,8.89
N$61
  Bottom 0.254: 39.12,10.92 arc-90 39.24,10.79 39.24,9.02
N$62
  Bottom 0.254: 31.5,10.92 31.5,9.02
N$63
  Bottom 0.254: 29.08,10.92 29.08,8.89
N$64
  Bottom 0.254: 24,10.67 arc-90 24.13,10.54 24.13,8.89
N$65
  Bottom 0.254: 21.59,10.67 21.59,9.14 arc90 21.72,9.02
N$66
  Bottom 0.254: 16.51,10.79 16.51,9.14
N$67
  Bottom 0.254: 13.97,10.79 arc90 13.84,10.67 13.84,8.89
N$68
  Bottom 0.254: 11.3,10.67 11.3,9.02
N$69
  Bottom 0.254: 8.89,10.92 arc90 8.76,10.79 8.76,8.89
N$70
  Bottom 0.254: 6.35,10.67 6.35,8.89 arc-90 6.22,8.76
VCC
  Bottom 0.61: JP22.29 JP2.29 JP4.29 JP6.29 JP8.29 JP10.29 JP12.29 JP14.29 JP16.29 JP18.29 JP20.29 JP24.29
(copper drawn outside any net)
  shapes: Bottom area x952

### Text on the board
Reference: 0T 0R 0C